# EAGLE design BuddyBand-BASIC-TOP (EAGLE 9.6.2)
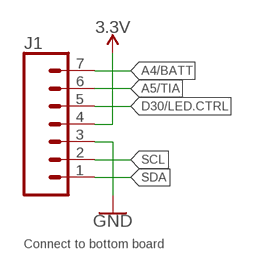
[diagram p0: schematic, sheet 1, part 1 of 2]
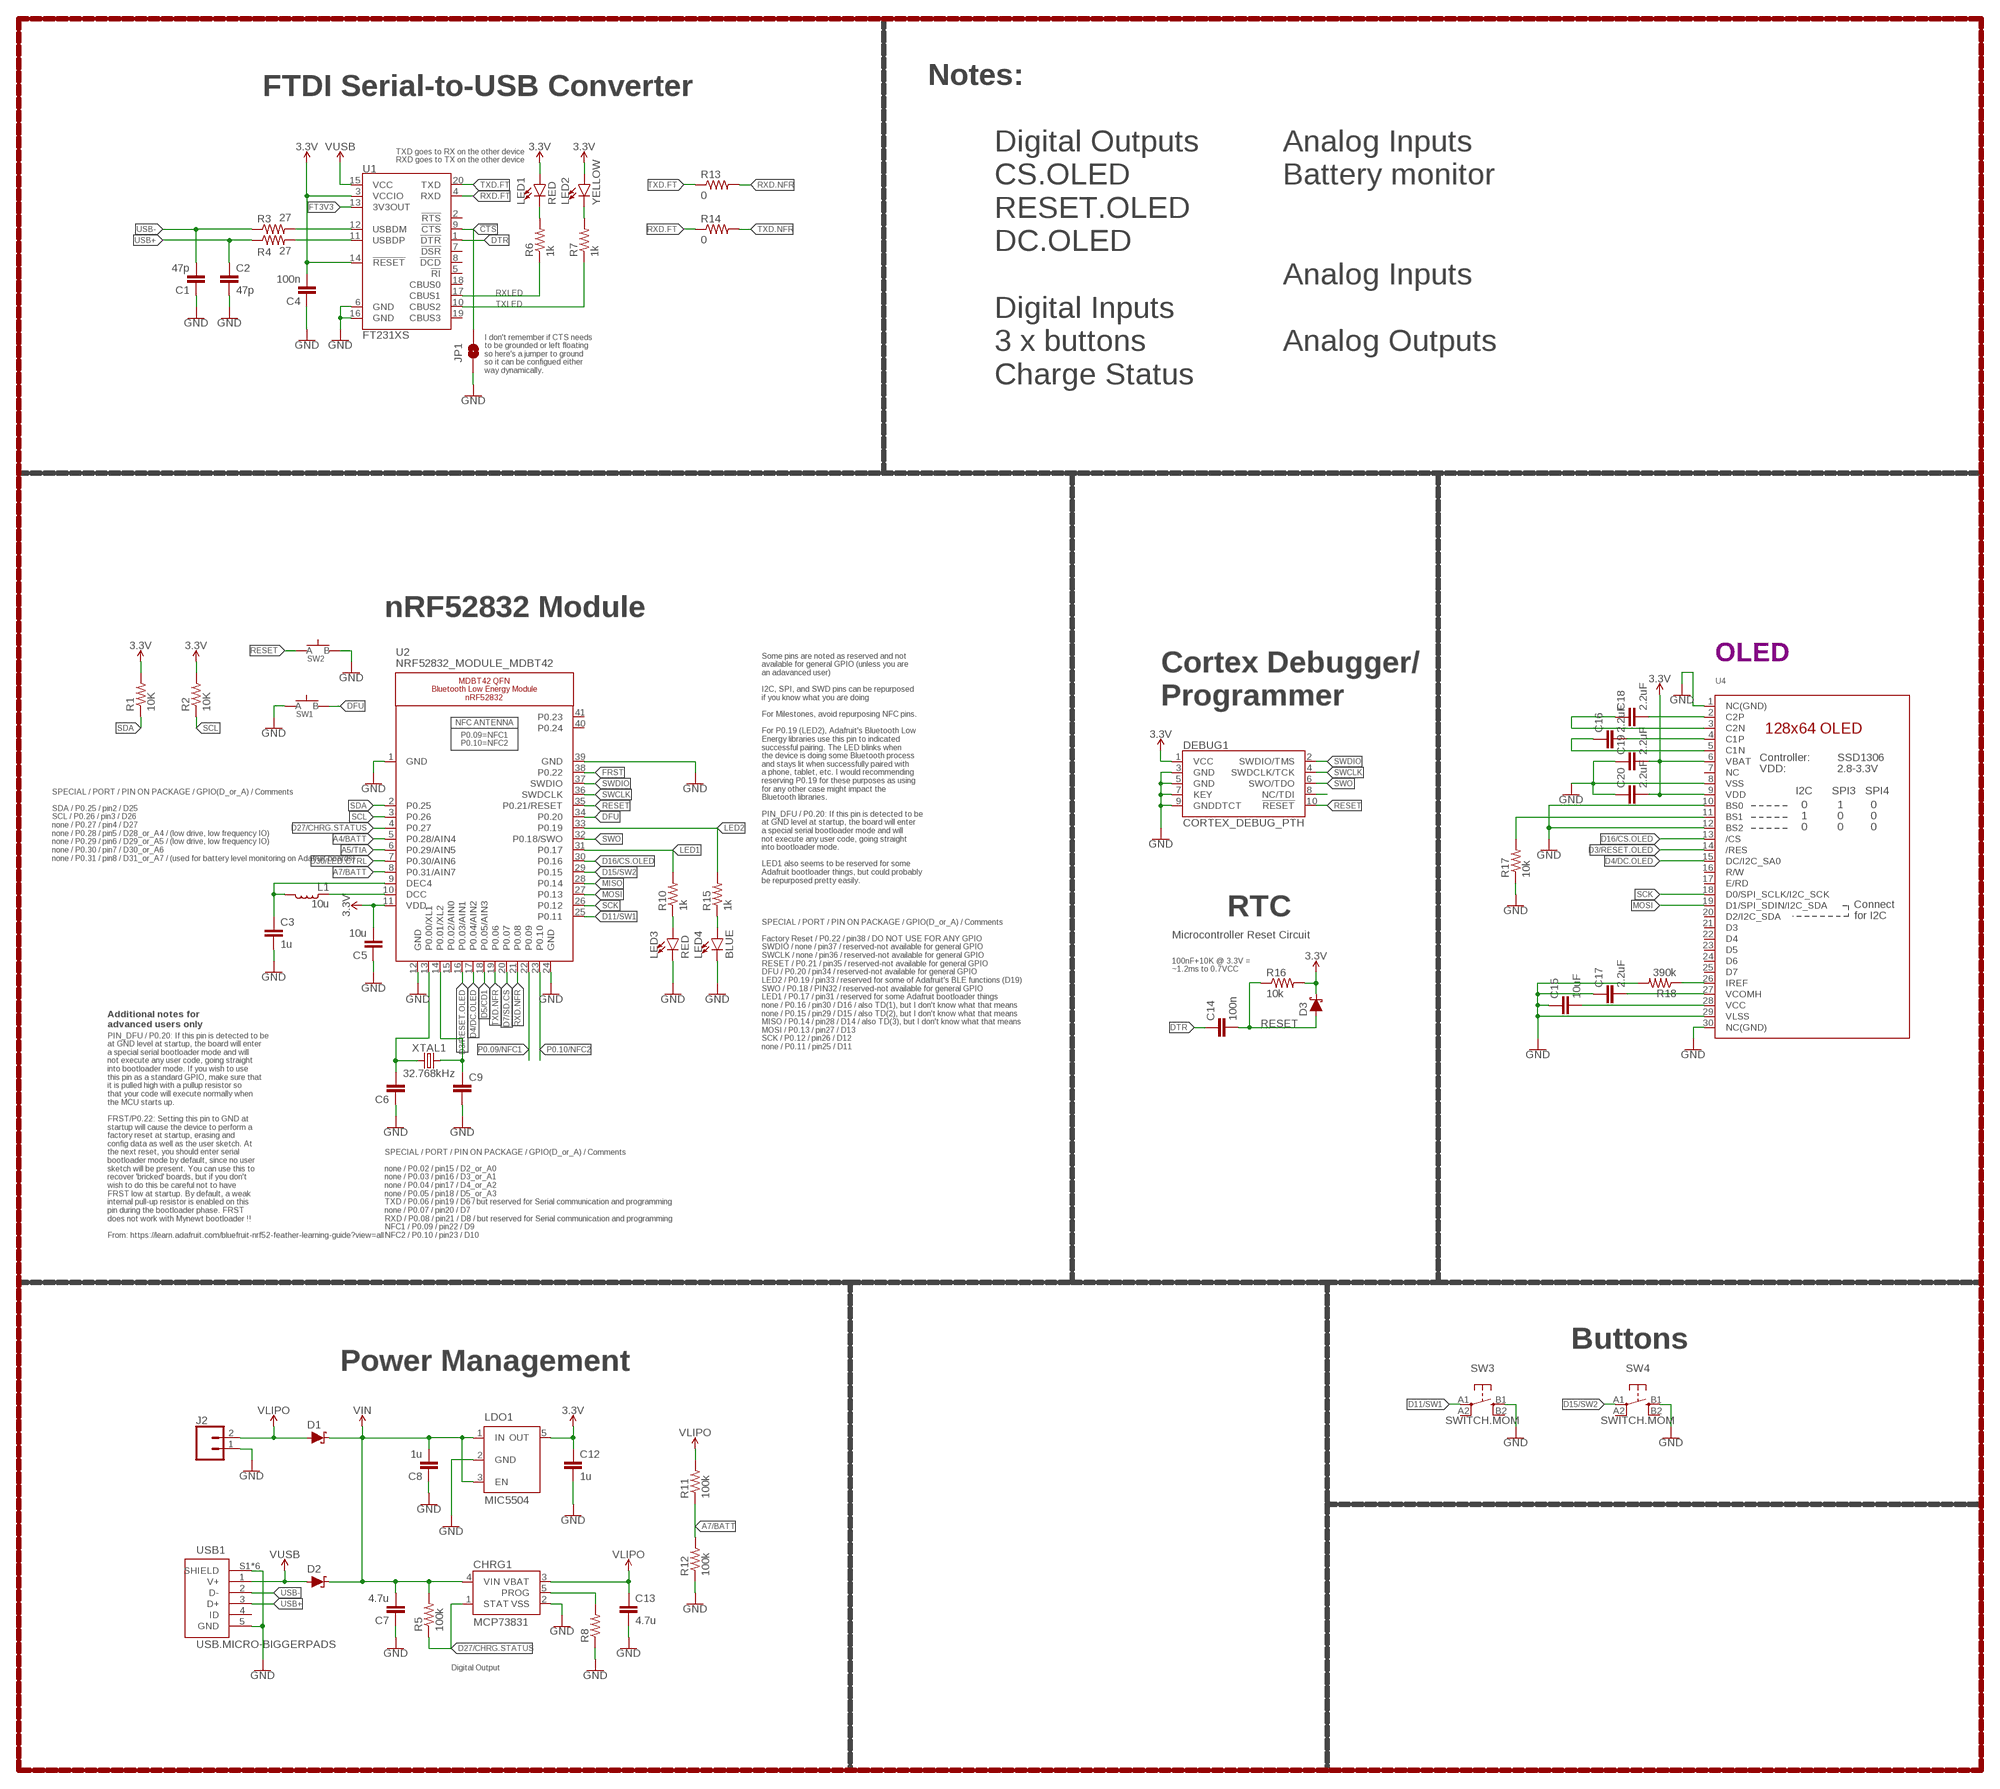
[diagram p1: schematic, sheet 1, part 2 of 2]

## Parts
C1  47p  CAPACITOR0603  [C0603]
C2  47p  CAPACITOR0603  [C0603]
C3  1u  CAPACITOR0603  [C0603]
C4  100n  CAPACITOR0603  [C0603]
C5  10u  CAPACITOR0805  [C0805]
C6  CAPACITOR0603  [C0603]
C7  4.7u  CAPACITOR0603  [C0603]
C8  1u  CAPACITOR0603  [C0603]
C9  CAPACITOR0603  [C0603]
C12  1u  CAPACITOR0603  [C0603]
C13  4.7u  CAPACITOR0603  [C0603]
C14  100n  CAPACITOR0603  [C0603]
C15  10uF  CAPACITOR0603  [C0603]
C16  2.2uF  CAPACITOR0402  [C0402]
C17  2.2uF  CAPACITOR0402  [C0402]
C18  2.2uF  CAPACITOR0402  [C0402]
C19  2.2uF  CAPACITOR0402  [C0402]
C20  2.2uF  CAPACITOR0402  [C0402]
CHRG1  MCP73831  [SOT23-5]
D1  SCHOTTKY-USC  [USC]
D2  SCHOTTKY-USC  [USC]
D3  SCHOTTKY-USC  [USC]
DEBUG1  CORTEX_DEBUG_PTH  [2X5-PTH-1.27MM]
J1  CONN_07-1.27MM  [1X07_1.27MM]
J2  CONN_02  [1X02]
JP1  JUMPER-SMT_2_NO_SILK  [SMT-JUMPER_2_NO_SILK]
L1  10u  INDUCTOR0603  [L0603]
LDO1  MIC5504  [SOT23-5]
LED1  RED  LED0603  [LED-0603]
LED2  YELLOW  LED0603  [LED-0603]
LED3  RED  LED0603  [LED-0603]
LED4  BLUE  LED0603  [LED-0603]
R1  10K  RESISTOR0603  [R0603]
R2  10K  RESISTOR0603  [R0603]
R3  27  RESISTOR0603  [R0603]
R4  27  RESISTOR0603  [R0603]
R5  100k  RESISTOR0603  [R0603]
R6  1k  RESISTOR0603  [R0603]
R7  1k  RESISTOR0603  [R0603]
R8  RESISTOR0603  [R0603]
R10  1k  RESISTOR0603  [R0603]
R11  100k  RESISTOR0603  [R0603]
R12  100k  RESISTOR0603  [R0603]
R13  0  RESISTOR0603  [R0603]
R14  0  RESISTOR0603  [R0603]
R15  1k  RESISTOR0603  [R0603]
R16  10k  RESISTOR0603  [R0603]
R17  10k  RESISTOR0603  [R0603]
R18  390k  RESISTOR0603  [R0603]
SW1  SPST-PTS830GG140-COPY.1-3  [BUTTON-GULLWING]
SW2  SPST-PTS830GG140-COPY.1-3  [BUTTON-GULLWING]
SW3  SWITCH.MOM  [TACTILE_SWITCH_SMD_6.2MM_TALL]
SW4  SWITCH.MOM  [TACTILE_SWITCH_SMD_6.2MM_TALL]
U1  FT231XS  [SSOP20_L]
U2  NRF52832_MODULE_MDBT42  [BLE_MODULE_RAYTAC_MDBT42]
U4  DISP_OLED_UG-2864HSWEG01-NO-WRAPAROUND  [UG-2864HSWEG01_0.96IN_NO-WRAPAROUND]
USB1  USB.MICRO-BIGGERPADS  [USB-MICRO-01.BIGGERPADS]
XTAL1  32.768kHz  CRYSTALECS-.327-12.5-12-C-TR  [2-SMD.NOLEAD.2.0MMTO1.2MM]

## Nets
3.3V: C4.2 C5.2 C12.1 C19.2 C20.2 D3.-(C) DEBUG1.1(VCC) J1.4 LDO1.5(OUT) LED1.A LED2.A R1.2 R2.2 R16.2 U1.3(VCCIO) U1.14(!RESET) U2.11(VDD) U4.6(VBAT) U4.9(VDD)
!CTS: JP1.2 U1.9(!CTS)
A4/BATT: J1.7 U2.5(P0.28/AIN4)
A5/TIA: J1.6 U2.6(P0.29/AIN5)
A7/BATT: R11.1 R12.2 U2.8(P0.31/AIN7)
D3/RESET.OLED: U2.16(P0.03/AIN1) U4.14(/RES)
D4/DC.OLED: U2.17(P0.04/AIN2) U4.15(DC/I2C_SA0)
D5/CD1: U2.18(P0.05/AIN3)
D7/SD.CS: U2.20(P0.07)
D11/SW1: SW3.A1 U2.25(P0.11)
D15/SW2: SW4.A1 U2.29(P0.15)
D16/CS.OLED: U2.30(P0.16) U4.13(/CS)
D27/CHRG.STATUS: CHRG1.1(STAT) R5.1 U2.4(P0.27)
D30/LED.CTRL: J1.5 U2.7(P0.30/AIN6)
DFU: SW1.3(B) U2.34(P0.20)
DTR: C14.1 U1.1(!DTR)
FRST: U2.38(P0.22)
FT3V3: U1.13(3V3OUT)
GND: C1.1 C2.2 C3.2 C4.1 C5.1 C6.1 C7.1 C8.1 C9.2 C12.2 C13.2 C15.1 C17.1 C19.1 C20.1 CHRG1.2(VSS) DEBUG1.3(GND) DEBUG1.5(GND) DEBUG1.7(KEY) DEBUG1.9(GNDDTCT) J1.3 J2.1 JP1.1 LDO1.2(GND) LED3.C LED4.C R8.1 R12.1 R17.1 R18.2 SW1.1(A) SW2.3(B) SW3.B1 SW4.B1 U1.6(GND) U1.16(GND) U2.1(GND) U2.12(GND) U2.24(GND) U2.39(GND) U4.1(NC(GND)) U4.8(VSS) U4.10(BS0) U4.12(BS2) U4.29(VLSS) U4.30(NC(GND)) USB1.5(GND) USB1.S1(SHIELD) USB1.S2(SHIELD) USB1.S3(SHIELD) USB1.S4(SHIELD) USB1.S5(SHIELD) USB1.S6(SHIELD)
LED1: R10.2 U2.31(P0.17)
LED2: R15.2 U2.33(P0.19)
MISO: U2.28(P0.14)
MOSI: U2.27(P0.13) U4.19(D1/SPI_SDIN/I2C_SDA)
N$1: R17.2 U4.11(BS1)
N$2: R18.1 U4.26(IREF)
N$3: C18.2 U4.2(C2P)
N$4: C6.2 U2.13(P0.00/XL1) XTAL1.P$1
N$5: C18.1 U4.3(C2N)
N$6: C9.1 U2.14(P0.01/XL2) XTAL1.P$2
N$7: C16.2 U4.4(C1P)
N$8: C16.1 U4.5(C1N)
N$9: LED3.A R10.1
N$10: LED4.A R15.1
N$11: L1.1 U2.10(DCC)
N$12: C3.1 L1.2 U2.9(DEC4)
N$13: C15.2 U4.28(VCC)
N$14: DEBUG1.8(NC/TDI)
N$15: C17.2 U4.27(VCOMH)
N$17: CHRG1.5(PROG) R8.2
N$23: R3.2 U1.12(USBDM)
N$24: R4.2 U1.11(USBDP)
N$25: LED1.C R6.2
N$26: LED2.C R7.2
P0.09/NFC1: U2.22(P0.09)
P0.10/NFC2: U2.23(P0.10)
RESET: C14.2 D3.+(A) DEBUG1.10(!RESET) R16.1 SW2.1(A) U2.35(P0.21/RESET)
RXD.FT: R14.1 U1.4(RXD)
RXD.NFR: R13.2 U2.21(P0.08)
RXLED: R6.1 U1.17(CBUS1)
SCK: U2.26(P0.12) U4.18(D0/SPI_SCLK/I2C_SCK)
SCL: J1.2 R2.1 U2.3(P0.26)
SDA: J1.1 R1.1 U2.2(P0.25)
SWCLK: DEBUG1.4(SWDCLK/TCK) U2.36(SWDCLK)
SWDIO: DEBUG1.2(SWDIO/TMS) U2.37(SWDIO)
SWO: DEBUG1.6(SWO/TDO) U2.32(P0.18/SWO)
TXD.FT: R13.1 U1.20(TXD)
TXD.NFR: R14.2 U2.19(P0.06)
TXLED: R7.1 U1.10(CBUS2)
USB+: C2.1 R4.1 USB1.3(D+)
USB-: C1.2 R3.1 USB1.2(D-)
V_USB: D2.+(A) U1.15(VCC) USB1.1(V+) ; supply symbol labelled VUSB
VIN: C7.2 C8.2 CHRG1.4(VIN) D1.-(C) D2.-(C) LDO1.1(IN) LDO1.3(EN) R5.2
VLIPO: C13.1 CHRG1.3(VBAT) D1.+(A) J2.2 R11.2
Unconnected: SW3.A2 SW3.B2 SW4.A2 SW4.B2 U1.2(!RTS) U1.5(!RI) U1.7(!DSR) U1.8(!DCD) U1.18(CBUS0) U1.19(CBUS3) U2.15(P0.02/AIN0) U2.40(P0.24) U2.41(P0.23) U4.7(NC) U4.16(R/W) U4.17(E/RD) U4.20(D2/I2C_SDA) U4.21(D3) U4.22(D4) U4.23(D5) U4.24(D6) U4.25(D7) USB1.4(ID)

## Notes on the sheet
- Notes:
- FTDI Serial-to-USB Converter
- TXD goes to RX on the other device
  RXD goes to TX on the other device
- Analog Inputs
  Battery monitor
  
  
  Analog Inputs
  
  Analog Outputs
- I don't remember if CTS needs
  to be grounded or left floating
  so here's a jumper to ground
  so it can be configued either
  way dynamically.
- Digital Outputs
  CS.OLED
  RESET.OLED
  DC.OLED
  
  Digital Inputs
  3 x buttons
  Charge Status
- nRF52832 Module
- Connect to bottom board
- OLED
- Cortex Debugger/
  Programmer
- SPECIAL / PORT / PIN ON PACKAGE / GPIO(D_or_A) / Comments
  
  SDA / P0.25 / pin2 / D25
  SCL / P0.26 / pin3 / D26
  none / P0.27 / pin4 / D27
  none / P0.28 / pin5 / D28_or_A4 / (low drive, low frequency IO)
  none / P0.29 / pin6 / D29_or_A5 / (low drive, low frequency IO)
  none / P0.30 / pin7 / D30_or_A6
  none / P0.31 / pin8 / D31_or_A7 / (used for battery level monitoring on Adafruit boards)
- Some pins are noted as reserved and not
  available for general GPIO (unless you are
  an adavanced user)
  
  I2C, SPI, and SWD pins can be repurposed
  if you know what you are doing
  
  For Milestones, avoid repurposing NFC pins.
  
  For P0.19 (LED2), Adafruit's Bluetooth Low
  Energy libraries use this pin to indicated
  successful pairing. The LED blinks when
  the device is doing some Bluetooth process
  and stays lit when successfully paired with
  a phone, tablet, etc. I would recommending
  reserving P0.19 for these purposes as using
  for any other case might impact the
  Bluetooth libraries.
  
  PIN_DFU / P0.20: If this pin is detected to be
  at GND level at startup, the board will enter
  a special serial bootloader mode and will
  not execute any user code, going straight
  into bootloader mode.
  
  LED1 also seems to be reserved for some
  Adafruit bootloader things, but could probably
  be repurposed pretty easily.
- RTC
- Microcontroller Reset Circuit
- 100nF+10K @ 3.3V =
  ~1.2ms to 0.7VCC
- Additional notes for
  advanced users only
- SPECIAL / PORT / PIN ON PACKAGE / GPIO(D_or_A) / Comments
  
  Factory Reset / P0.22 / pin38 / DO NOT USE FOR ANY GPIO
  SWDIO / none / pin37 / reserved-not available for general GPIO
  SWCLK / none / pin36 / reserved-not available for general GPIO
  RESET / P0.21 / pin35 / reserved-not available for general GPIO
  DFU / P0.20 / pin34 / reserved-not available for general GPIO
  LED2 / P0.19 / pin33 / reserved for some of Adafruit's BLE functions (D19)
  SWO / P0.18 / PIN32 / reserved-not available for general GPIO
  LED1 / P0.17 / pin31 / reserved for some Adafruit bootloader things
  none / P0.16 / pin30 / D16 / also TD(1), but I don't know what that means
  none / P0.15 / pin29 / D15 / also TD(2), but I don't know what that means
  MISO / P0.14 / pin28 / D14 / also TD(3), but I don't know what that means
  MOSI / P0.13 / pin27 / D13
  SCK / P0.12 / pin26 / D12
  none / P0.11 / pin25 / D11
- PIN_DFU / P0.20: If this pin is detected to be
  at GND level at startup, the board will enter
  a special serial bootloader mode and will
  not execute any user code, going straight
  into bootloader mode. If you wish to use
  this pin as a standard GPIO, make sure that
  it is pulled high with a pullup resistor so
  that your code will execute normally when
  the MCU starts up.
  
  FRST/P0.22: Setting this pin to GND at
  startup will cause the device to perform a
  factory reset at startup, erasing and
  config data as well as the user sketch. At
  the next reset, you should enter serial
  bootloader mode by default, since no user
  sketch will be present. You can use this to
  recover 'bricked' boards, but if you don't
  wish to do this be careful not to have
  FRST low at startup. By default, a weak
  internal pull-up resistor is enabled on this
  pin during the bootloader phase. FRST
  does not work with Mynewt bootloader !!
  
  From: https://learn.adafruit.com/bluefruit-nrf52-feather-learning-guide?view=all
- SPECIAL / PORT / PIN ON PACKAGE / GPIO(D_or_A) / Comments
  
  none / P0.02 / pin15 / D2_or_A0
  none / P0.03 / pin16 / D3_or_A1
  none / P0.04 / pin17 / D4_or_A2
  none / P0.05 / pin18 / D5_or_A3
  TXD / P0.06 / pin19 / D6 / but reserved for Serial communication and programming
  none / P0.07 / pin20 / D7
  RXD / P0.08 / pin21 / D8 / but reserved for Serial communication and programming
  NFC1 / P0.09 / pin22 / D9
  NFC2 / P0.10 / pin23 / D10
- Buttons
- Power Management
- Digital Output

## Library data of the parts
C1-C9 C12-C20 = LinnesLab-Passives:CAPACITOR
CHRG1 = LinnesLab-Power:MCP73831: MCP73831T Li-Ion, Li-Pol Controller Miniature single cell, fully integrated Li-Ion, Li-polymer charge management controller Datasheet <http://ww1.microchip.com/downloads/en/DeviceDoc/20001984g.pdf> SparkFun Products: SparkFun ESP32 Thing <https://www.sparkfun.com/products/13907> SparkFun 9DoF Razor IMU M0 <https://www.sparkfun.com/products/14001>; PROD_ID: IC-09995
D1-D3 = LinnesLab-DiscreteSemi:SCHOTTKY: Schottky diode A Schottky diode is a semiconductor diode which has a low forward voltage drop and a very fast switching action. Example: Digi-Key Part Number: RB161MM-20CT-ND
DEBUG1 = LinnesLab-Connectors:CORTEX_DEBUG: Cortex Debug Connector - 10 pin Supports JTAG debug, Serial Wire debug, and Serial Wire Viewer. PTH and SMD connector options available. General Connector Information <http://infocenter.arm.com/help/topic/com.arm.doc.faqs/attached/13634/cortex_debug_connectors.pdf> Products: PTH Connector <http://www.digikey.com/product-detail/en/cnc-tech/3220-10-0100-00/1175-1627-ND/3883661> -via Digi-Key SparkFun PSoc <https://www.sparkfun.com/products/13229> SparkFun T <https://www.sparkfun.com/products/13810>
J1 = LinnesLab-Connectors:CONN_07: Multi connection point. Often used as Generic Header-pin footprint for 0.1 inch spaced/style header connections On any of the 0.1 inch spaced packages, you can populate with these: Break Away Headers - Straight <https://www.sparkfun.com/products/116> (PRT-00116) Break Away Male Headers - Right Angle <https://www.sparkfun.com/products/553> (PRT-00553) Female Headers <https://www.sparkfun.com/products/115> (PRT-00115) Break Away Headers - Machine Pin <https://www.sparkfun.com/products/117> (PRT-00117) Break Away Female Headers - Swiss Machine Pin <https://www.sparkfun.com/products/743> (PRT-00743) For SCREWTERMINALS and SPRING TERMINALS visit here: Screw Terimnals on SparkFun.com <https://www.sparkfun.com/search/results?term=Screw+Terminals> (5mm/3.5mm/2.54mm spacing) This device is also useful as a general connection point to wire up your design to another part of your project. Our various solder wires solder well into these plated through hole pads. Hook-Up Wire - Assortment (Stranded, 22 AWG) <https://www.sparkfun.com/products/11375> (PRT-11375) Hook-Up Wire - Assortment (Solid Core, 22 AWG) <https://www.sparkfun.com/products/11367> (PRT-11367) View the entire wire category on our website here <https://www.sparkfun.com/categories/141> Special notes: Molex polarized connector foot print use with SKU : PRT-08231 with associated crimp pins and housings. 1MM SMD Version SKU: PRT-10208 NOTES ON THE VARIANTS LOCK and LOCK_LONGPADS... This footprint was designed to help hold the alignment of a through-hole component (i.e. 6-pin header) while soldering it into place. You may notice that each hole has been shifted either up or down by 0.005 of an inch from it's more standard position (which is a perfectly straight line). This slight alteration caused the pins (the squares in the middle) to touch the edges of the holes. Because they are alternating, it causes a "brace" to hold the component in place. 0.005 has proven to be the perfect amount of "off-center" position when using our standard breakaway headers. Although looks a little odd when you look at the bare footprint, once you have a header in there, the alteration is very hard to notice. Also,if you push a header all the way into place, it is covered up entirely on the bottom side.
J2 = LinnesLab-Connectors:CONN_02: Multi connection point. Often used as Generic Header-pin footprint for 0.1 inch spaced/style header connections On any of the 0.1 inch spaced packages, you can populate with these: Break Away Headers - Straight <https://www.sparkfun.com/products/116> (PRT-00116) Break Away Male Headers - Right Angle <https://www.sparkfun.com/products/553> (PRT-00553) Female Headers <https://www.sparkfun.com/products/115> (PRT-00115) Break Away Headers - Machine Pin <https://www.sparkfun.com/products/117> (PRT-00117) Break Away Female Headers - Swiss Machine Pin <https://www.sparkfun.com/products/743> (PRT-00743) For SCREWTERMINALS and SPRING TERMINALS visit here: Screw Terimnals on SparkFun.com <https://www.sparkfun.com/search/results?term=Screw+Terminals> (5mm/3.5mm/2.54mm spacing) This device is also useful as a general connection point to wire up your design to another part of your project. Our various solder wires solder well into these plated through hole pads. Hook-Up Wire - Assortment (Stranded, 22 AWG) <https://www.sparkfun.com/products/11375> (PRT-11375) Hook-Up Wire - Assortment (Solid Core, 22 AWG) <https://www.sparkfun.com/products/11367> (PRT-11367) View the entire wire category on our website here <https://www.sparkfun.com/categories/141> Special notes: Molex polarized connector foot print use with: PRT-08233 with associated crimp pins and housings. 2.54_SCREWTERM for use with PRT-10571. 3.5mm Screw Terminal footprints for PRT-08084 5mm Screw Terminal footprints for use with PRT-08432
JP1 = LinnesLab-Switches:JUMPER-SMT_2_NO: Normally open jumper This jumper has two pads in close proximity to each other. Apply solder to close the connection. Round pads are easier to solder for beginners, but are a lot larger. SparkFun Product that uses the round pads: SparkFun EL Sequencer <https://www.sparkfun.com/products/12781>
L1 = LinnesLab-Passives:INDUCTOR
LDO1 = LinnesLab-Power:MIC5504: MIC5504 Voltage Regulator Output Voltages: 1.0V to 3.3V Input Voltages: 2.5V to 5.5V Link to Datasheet http://ww1.microchip.com/downloads/en/DeviceDoc/MIC550X.pdf
LED1-LED4 = LinnesLab-LED:LED: LED (Generic) Standard schematic elements and footprints for 5mm, 3mm, 1206, and 0603 sized LEDs. Generic LEDs with no color specified. LTST-C190KGKT: arrow indicates cathode
R1-R8 R10-R18 = LinnesLab-Passives:RESISTOR
SW1 SW2 = LinnesLab-Switches:SPST-PTS830GG140-COPY
SW3 SW4 = LinnesLab-Switches:SWITCH.MOM: PTS645SM43SMTR92 LFS
U1 = LinnesLab-DigitalIC:FT231X: FTDI FT231X Full Speed USB to Full-handshake UART This USB2.0 Full Speed IC offers a compact bridge to full handshake UART interfaces. The device is a UART, capable of operating up to 3MBaud, with low power consumption (8mA). The FT231X includes the complete FT-X series feature set and enables USB to be added into a system design quickly and easily over a UART interface. Datasheet <http://cdn.sparkfun.com/datasheets/Components/General%20IC/DS_FT231X.pdf>; DIGIKEY: 768-1156-5-ND; MFN: FT231XS-U
U2 = LinnesLab-Microcontrollers:NRF52832_MODULE_MDBT42: MDBT42 - BLE Module (nRF52832 QFN) VDD: 1.7-3.6V
U4 = LinnesLab-Displays:DISP_OLED_UG-2864HSWEG01: UG-2864HSWEG01 OLED display Both 1.3" and 0.96" models share the same FPC tab footprint, only the screen dimensions vary.
USB1 = LinnesLab-Connectors:USB.MICRO: DigiKey PN: 609-4613-1-ND
XTAL1 = LinnesLab-Clocks:CRYSTAL; DIGIKEY: XC2288CT-ND; FREQ: 32.7680KHZ; LOAD_CAP: 12.5pF

## Board
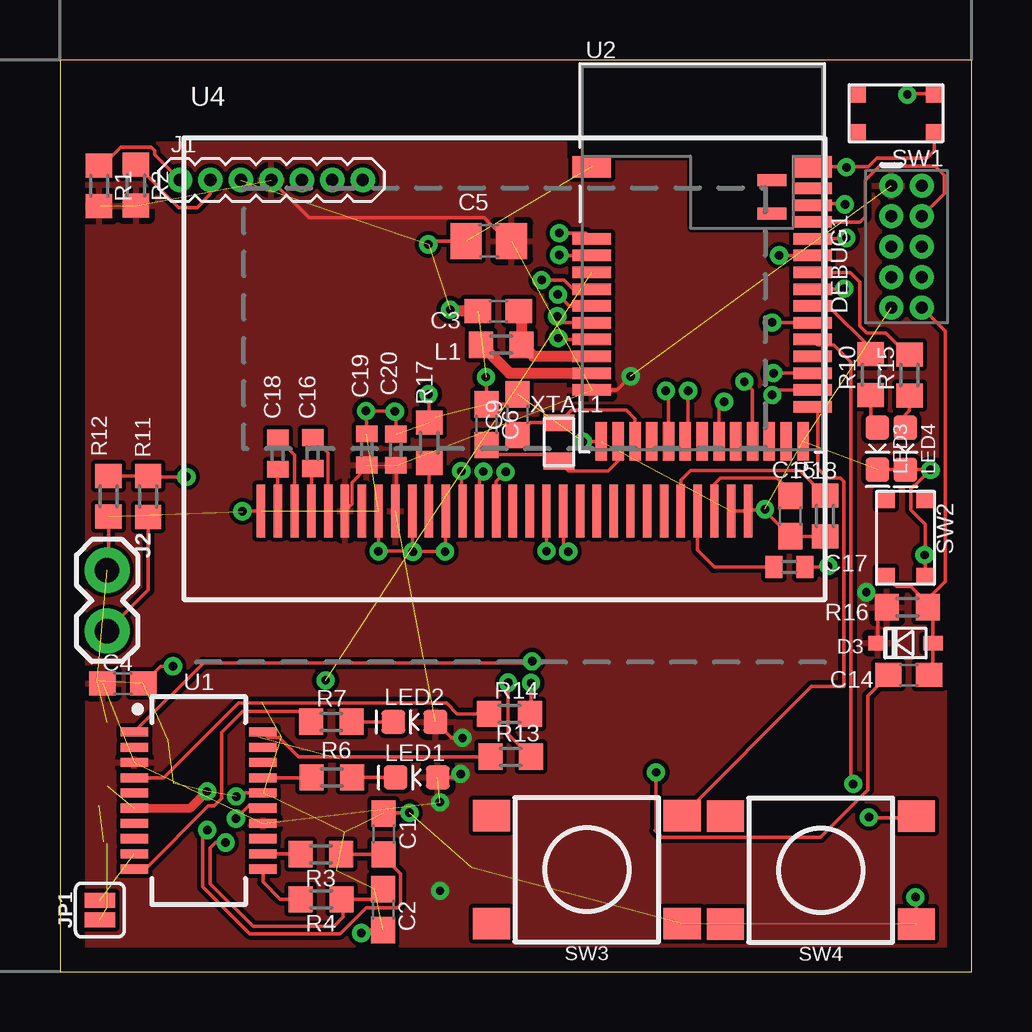
[diagram p2: board, top side]
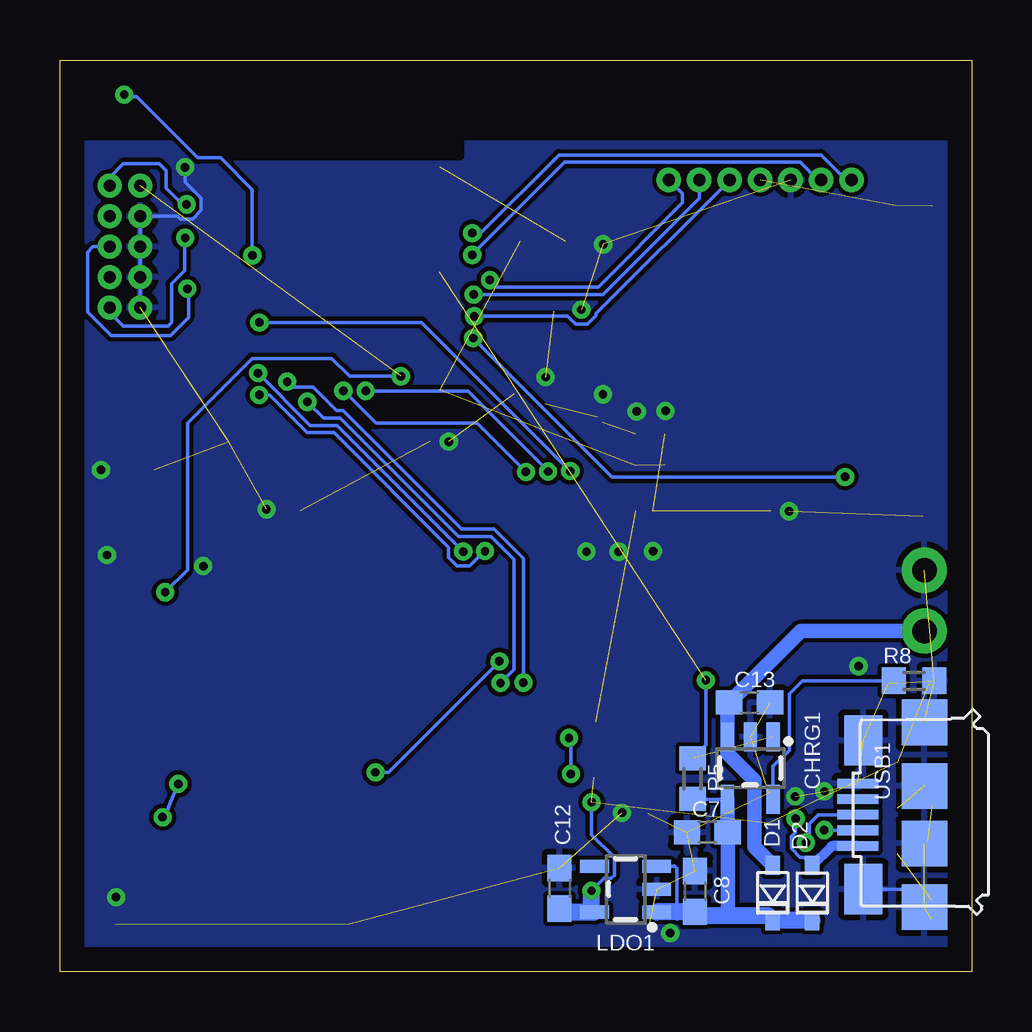
[diagram p3: board, bottom side, seen from below]

Size 38 x 38 mm. Coordinates in mm from the lower left corner, seen from the top.
Outline: 0,0 38,0 38,38 0,38 0,0
Copper layers (1*16): Top 0.035mm / dielectric 1.5mm / Bottom 0.035mm
Design rules "default": minimum track width 6mil, minimum drill 0.35mm, track to track 6mil, track to pad 6mil, pad to pad 6mil, via to via 6mil, smd to smd 6mil, copper to edge 40mil, drill to drill 6mil, minimum pad ring 10mil, minimum via ring 8mil, stop-mask expansion 4mil, vias tented up to drill 0mil, thermal gap 10mil

### Footprints (pad centres in the part's own frame; a part is rotated, then mirrored left to right if it is on the bottom)
C0603 = smd 1.1 x 1: 1 -0.85,0; 2 0.85,0
C0805 = smd 1.3 x 1.5: 1 -0.95,0; 2 0.95,0
C0402 = smd 0.7 x 0.9: 1 -0.65,0; 2 0.65,0
SOT23-5 = smd 0.55 x 1.2: 1 -0.95,-1.3; 2 0,-1.3; 3 0.95,-1.3; 4 0.95,1.3; 5 -0.95,1.3
USC = smd 0.8 x 0.6: + -1.15,0; - 1.15,0
2X5-PTH-1.27MM = drill 0.508 pad 1: 1 -2.54,-0.635; 2 -2.54,0.635; 3 -1.27,-0.635; 4 -1.27,0.635; 5 0,-0.635; 6 0,0.635; 7 1.27,-0.635; 8 1.27,0.635; 9 2.54,-0.635; 10 2.54,0.635
1X07_1.27MM = drill 0.508 pad 1: 1 0,0; 2 1.27,0; 3 2.54,0; 4 3.81,0; 5 5.08,0; 6 6.35,0; 7 7.62,0
1X02 = drill 1.016 pad 1.88: 1 0,0; 2 2.54,0
SMT-JUMPER_2_NO_SILK = smd 0.635 x 1.27: 1 -0.406,0; 2 0.406,0
L0603 = smd 1 x 1.1: 1 -0.85,0; 2 0.85,0
LED-0603 = smd 1 x 1: A -0.877,0; C 0.877,0
R0603 = smd 1 x 1.1: 1 -0.85,0; 2 0.85,0
BUTTON-GULLWING = smd 0.7 x 0.75: 1 -1.6,0.825; 2 1.6,0.825; 3 -1.6,-0.825; 4 1.6,-0.825
TACTILE_SWITCH_SMD_6.2MM_TALL = smd 1.55 x 1.3: A1 -3.975,-2.25; A2 3.975,-2.25; B1 -3.975,2.25; B2 3.975,2.25
SSOP20_L = smd 0.381 x 1.143: 1 -2.857,-2.68; 2 -2.223,-2.68; 3 -1.587,-2.68; 4 -0.953,-2.68; 5 -0.318,-2.68; 6 0.318,-2.68; 7 0.953,-2.68; 8 1.587,-2.68; 9 2.223,-2.68; 10 2.857,-2.68; 11 2.857,2.68; 12 2.223,2.68; 13 1.587,2.68; 14 0.953,2.68; 15 0.318,2.68; 16 -0.318,2.68; 17 -0.953,2.68; 18 -1.587,2.68; 19 -2.223,2.68; 20 -2.857,2.68
BLE_MODULE_RAYTAC_MDBT42 = smd 1.6 x 0.9: 1 -4.6,3.8; 39 4.6,3.8 | smd 1.6 x 0.48: 2 -4.6,0.8; 3 -4.6,0.1; 4 -4.6,-0.6; 5 -4.6,-1.3; 6 -4.6,-2; 7 -4.6,-2.7; 8 -4.6,-3.4; 9 -4.6,-4.1; 10 -4.6,-4.8; 11 -4.6,-5.5; 25 4.6,-6.2; 26 4.6,-5.5; 27 4.6,-4.8; 28 4.6,-4.1; 29 4.6,-3.4; 30 4.6,-2.7; 31 4.6,-2; 32 4.6,-1.3; 33 4.6,-0.6; 34 4.6,0.1; 35 4.6,0.8; 36 4.6,1.5; 37 4.6,2.2; 38 4.6,2.9 | smd 0.48 x 1.6: 12 -4.2,-7.65; 13 -3.5,-7.65; 14 -2.8,-7.65; 15 -2.1,-7.65; 16 -1.4,-7.65; 17 -0.7,-7.65; 18 0,-7.65; 19 0.7,-7.65; 20 1.4,-7.65; 21 2.1,-7.65; 22 2.8,-7.65; 23 3.5,-7.65; 24 4.2,-7.65 | smd 1.2 x 0.5: 40 2.9,3.25; 41 2.9,1.85
UG-2864HSWEG01_0.96IN_NO-WRAPAROUND = smd 0.35 x 2.2: 1 -10.15,-1.2; 2 -9.45,-1.2; 3 -8.75,-1.2; 4 -8.05,-1.2; 5 -7.35,-1.2; 6 -6.65,-1.2; 7 -5.95,-1.2; 8 -5.25,-1.2; 9 -4.55,-1.2; 10 -3.85,-1.2; 11 -3.15,-1.2; 12 -2.45,-1.2; 13 -1.75,-1.2; 14 -1.05,-1.2; 15 -0.35,-1.2; 16 0.35,-1.2; 17 1.05,-1.2; 18 1.75,-1.2; 19 2.45,-1.2; 20 3.15,-1.2; 21 3.85,-1.2; 22 4.55,-1.2; 23 5.25,-1.2; 24 5.95,-1.2; 25 6.65,-1.2; 26 7.35,-1.2; 27 8.05,-1.2; 28 8.75,-1.2; 29 9.45,-1.2; 30 10.15,-1.2
USB-MICRO-01.BIGGERPADS = smd 0.4 x 1.7: 1 -1.3,1.505; 2 -0.65,1.505; 3 0,1.505; 4 0.65,1.505; 5 1.3,1.505 | smd 1.9 x 1.9: S1 -3.85,-1.27; S2 -1.2,-1.27; S3 1.2,-1.27; S4 3.85,-1.27 | smd 2.1 x 1.6: S5 -3.1,1.28; S6 3.1,1.28
2-SMD.NOLEAD.2.0MMTO1.2MM = smd 0.7 x 1.3: P$1 -0.8,0; P$2 0.8,0

### Placement (x,y rotation side)
C1  13.5,5.74 270 top
C2  13.46,2.58 270 top
C3  18.27,27.52 180 top
C4  2.63,12.01 180 top
C5  17.88,30.45 0 top
C6  17.77,22.8 270 top
C7  11.01,5.8 0 bottom
C8  11.53,3.34 270 bottom
C9  19.08,23.21 90 top
C12  17.17,3.47 90 bottom
C13  9.25,11.21 0 bottom
C14  35.38,12.35 0 top
C15  30.44,18.99 90 top
C16  10.54,21.61 270 top
C17  30.41,16.86 180 top
C18  9.08,21.59 270 top
C19  12.79,21.76 270 top
C20  14,21.75 270 top
CHRG1  9.22,8.48 180 bottom
D1  8.29,3.28 270 bottom
D2  6.64,3.27 270 bottom
D3  35.25,13.69 180 top
DEBUG1  35.29,30.22 270 top
J1  5,33 0 top
J2  1.96,16.73 270 top
JP1  1.66,2.56 90 top
L1  18.4,26.13 0 top
LDO1  14.42,3.43 90 bottom
LED1  14.87,8.09 180 top
LED2  14.78,10.41 180 top
LED3  34.08,21.8 270 top
LED4  35.24,21.8 270 top
R1  1.63,32.75 270 top
R2  3.17,32.78 270 top
R3  10.88,4.89 180 top
R4  10.89,3.01 180 top
R5  11.63,8.04 270 bottom
R6  11.33,8.09 0 top
R7  11.32,10.41 0 top
R8  2.4,12.12 180 bottom
R10  33.79,24.88 90 top
R11  3.68,19.8 270 top
R12  2.02,19.81 90 top
R13  18.79,8.95 0 top
R14  18.74,10.74 0 top
R15  35.41,24.86 90 top
R16  35.33,15.19 180 top
R17  15.39,22.04 270 top
R18  31.89,18.99 270 top
SW1  34.85,35.77 180 top
SW2  35.25,18.08 90 top
SW3  21.96,4.25 180 top
SW4  31.72,4.23 180 top
U1  5.78,7.13 270 top
U2  26.77,29.75 0 top
U4  18.53,20.4 0 top
USB1  3.23,6.54 90 bottom
XTAL1  20.8,22.08 90 top

### Tracks (layer width: path | path; a pad name or v marks a point on that pad's centre or on a via)
3.3V  (via drill 0.35)  (11 unrouted)
  Top 0.152: C20.2 14,19.22 U4.9 | U4.6 12.18,19.5 12.18,20.39 12.79,21.01 C19.2 | D3.- 34.09,14.8 R16.2 33.85,15.81 v33.61,15.81 | v23.79,24.81 23.22,24.25 U2.11 | C5.2 18.65,30.45 17.67,31.43 10.38,31.43 J1.4 | LED1.A 16.56,8.09 v16.7,8.23 | v16.78,9.73 16.33,9.73 LED2.A
  Bottom 0.152: v33.61,15.81 32.69,16.74 32.69,22.86 30,25.55 26.67,25.55 25.93,24.81 v23.79,24.81 | v15.85,3.37 15.33,3.88 15.03,3.88 14.89,4.01 14.89,4.75 15.84,5.7 v15.84,7.06 | v16.7,8.23 16.7,9.66 v16.78,9.73
  Bottom 0.711: C12.1 17.03,2.48 LDO1.5 15.85,2.6 v15.85,3.37
  pour Top (isolate 0.178): 37.81,34.53 37.81,0.17 0.18,0.17 0.18,34.53
!CTS  (1 unrouted)
A4/BATT  (via drill 0.35)
  Top 0.152: U2.5 21.39,28.45 21.01,28.83 v20.08,28.83
  Bottom 0.152: v20.08,28.83 19.78,28.53 15.56,28.53 12.05,32.04 12.05,32.43 J1.7
A5/TIA  (via drill 0.35)
  Top 0.152: U2.6 21.23,27.75 v20.76,28.22
  Bottom 0.152: v20.76,28.22 15.36,28.22 11.35,32.23 J1.6
A7/BATT  (via drill 0.35)
  Top 0.152: R11.1 3.53,20.65 | 3.53,20.65 2.03,20.65 R12.2 | U2.8 20.83,26.35 v20.77,26.41 | v5.27,20.62 3.56,20.62 3.53,20.65
  Bottom 0.152: v20.77,26.41 14.99,20.62 v5.27,20.62
D3/RESET.OLED  (via drill 0.35)
  Top 0.152: U4.14 17.48,20.67 v17.65,20.84 | U2.16 25.37,24.09 v25.26,24.21
  Bottom 0.152: v17.65,20.84 17.65,20.86 21,24.21 v25.26,24.21
D4/DC.OLED  (via drill 0.35)
  Top 0.152: U4.15 18.18,20.43 v18.58,20.83 | v26.19,24.21 26.19,22.21 U2.17
  Bottom 0.152: v26.19,24.21 v26.18,24.21 24.83,22.86 20.61,22.86 v18.58,20.83
D11/SW1
  Top 0.152: U2.25 31.59,23.33 31.59,20.97 31.99,20.57 32.54,20.57 32.69,20.42 32.69,11.89 31.33,11.89 SW3.A1
D15/SW2  (via drill 0.35)
  Top 0.152: U2.29 31.6,26.11 32.27,26.11 32.97,25.41 32.97,7.92 v33.07,7.82 | v33.72,6.43 33.75,6.41 35.62,6.41 SW4.A1
  Bottom 0.152: v33.72,6.43 33.64,6.43 33.44,6.97 v33.07,7.82
D16/CS.OLED  (via drill 0.35)
  Top 0.152: U4.13 16.73,19.25 v16.73,20.86 | v29.69,27.06 U2.30
  Bottom 0.152: v16.73,20.86 22.93,27.06 v29.69,27.06
D27/CHRG.STATUS  (via drill 0.35)  (2 unrouted)
  Bottom 0.152: R5.1 11.07,9.45 v11.07,12.14
D30/LED.CTRL  (via drill 0.35)
  Top 0.152: U2.7 20.99,27.05 v20.73,27.31
  Bottom 0.152: v20.73,27.31 16.84,27.31 16.52,26.99 16.01,26.99 15.66,27.34 15.66,27.42 J1.5
DFU  (via drill 0.35)
  Top 0.152: U2.34 29.99,29.85 v29.98,29.86 | SW1.3 35.36,36.6 v35.32,36.56
  Bottom 0.152: v29.98,29.86 29.98,32.6 31.31,33.92 32.25,33.92 34.8,36.47 35.32,36.47 v35.32,36.56
DTR  (via drill 0.35)
  Top 0.152: C14.1 33.68,11.5 33.68,7.57 31.71,5.6 25.09,5.6 24.8,5.88 24.85,5.93 v24.85,8.3 | U1.1 5.99,12.87 19.62,12.87 v19.68,12.93
  Bottom 0.152: v19.68,12.93 24.31,8.3 v24.85,8.3
GND  (via drill 0.35)  (35 unrouted)
  Top 0.152: U4.1 7.62,19.2 v7.61,19.19 | C19.1 12.79,23.33 v12.75,23.37 13.94,23.37 v13.96,23.35 14,23.3 C20.1 | U4.8 v13.28,17.53 v13.27,17.52 14.69,17.52 v14.71,17.5 | v15.36,24.06 15.39,24.03 R17.1 15.61,23.11 | U4.10 14.71,19.17 v14.71,17.5 | U4.12 16.08,17.54 v16.05,17.51 v16.05,17.5 v14.71,17.5 | U4.29 U4.30 28.72,19.24 29.39,19.24 v29.39,19.27 29.39,19.2 C15.1 R18.2 31.89,17.04 v32.03,16.9 31.99,16.86 C17.1 | C1.1 13.53,6.62 v14.57,6.62 | C2.2 12.69,1.73 v12.56,1.6 | R12.1 2.02,16.79 J2.1 | C9.2 18.66,23.65 C6.1 17.77,24.77 v17.76,24.78 | U2.12 v21.8,22.1 v21.79,22.09 | LED3.C LED4.C v36.28,20.92 v36.29,20.91 35.63,20.26 35.6,20.26 35.47,20.12 35.47,19.23 36.07,18.63 36.07,17.33 | SW2.3 36.07,17.33 | 36.07,17.33 v36.04,17.36 | U2.39 32.77,33.55 | 32.77,33.55 v32.79,33.52 | SW4.B1 35.69,3.07 v35.66,3.1 | C5.1 15.5,30.45 v15.36,30.32 | U1.16 7.5,7.45 v7.35,7.3 | C4.1 4.19,12.73 v4.71,12.73 | SW1.1 36.45,34.21 36.13,33.9 34.04,33.9 33.69,33.55 32.77,33.55
  Top 0.356: U1.6 5.43,6.81 v6.13,7.51
  Top 0.457: C3.2 16.34,27.52 v16.26,27.59
  Bottom 0.152: DEBUG1.9 DEBUG1.7 DEBUG1.5 DEBUG1.3 33.09,31.49 32.98,31.37 32.47,31.37 32.12,31.73 32.12,32.23 32.79,32.9 v32.79,33.52 | USB1.S2 1.93,5.3 1.92,5.31 1.83,5.4 | USB1.S1 2.71,3.44 USB1.S5 | USB1.S3 1.96,7.24 1.64,6.92
  pour Bottom (isolate 0.178): 37.78,34.58 0.15,34.58 0.15,0.17 37.77,0.17
LED1
  Top 0.152: R10.2 33.8,25.99 32.04,27.75 U2.31
LED2
  Top 0.152: R15.2 35.32,25.71 34.42,26.61 33.64,26.61 33.34,26.91 33.34,28.75 32.95,29.14 31.38,29.14 U2.33
MOSI  (via drill 0.35)
  Top 0.152: U4.19 20.98,17.72 v21.19,17.51 | U2.27 v29.75,24.95
  Bottom 0.152: v21.19,17.51 26.45,22.77 27.57,22.77 v29.75,24.95
N$1
  Top 0.152: U4.11 15.39,19.21 R17.2
N$2
  Top 0.152: R18.1 30.85,20.88 26.27,20.88 25.88,20.49 U4.26
N$3
  Top 0.152: C18.2 U4.2
N$4
  Top 0.152: U2.13 23.32,22.05 23.32,21.34 22.85,20.87 21.2,20.87 XTAL1.P$1 | 17.84,21.95 C6.2 17.83,21.95 18.22,21.55 20.52,21.55 XTAL1.P$1 | 20.48,21.27 XTAL1.P$1
N$5
  Top 0.152: C18.1 9.78,21.54 U4.3
N$6
  Top 0.152: 24.02,22.05 U2.14 23.97,23.04 23.61,23.41 21.33,23.41 20.82,22.9 | XTAL1.P$2 20.82,22.9 | C9.1 19.61,22.9 20.82,22.9
N$7
  Top 0.152: C16.2 10.48,20.91 U4.4
N$8
  Top 0.152: C16.1 11.18,21.62 U4.5
N$9
  Top 0.152: R10.1 33.8,22.96 LED3.A
N$10
  Top 0.152: R15.1 35.41,23.39 35.24,23.22 LED4.A
N$11
  Top 0.457: L1.1 18.73,24.95 U2.10
N$12
  Top 0.457: U2.9 19.73,25.65 L1.2 19.25,27.4 C3.1
N$13
  Top 0.152: C15.2 30.44,20.01 29.89,20.57 27.53,20.57 27.28,20.32 U4.28
N$15
  Top 0.152: 26.58,20.23 U4.27 26.58,17.56 27.28,16.86 C17.2
N$17
  Bottom 0.152: R8.2 7.05,12.12 7.59,11.58 7.59,9.22 8.27,8.54 CHRG1.5
N$23
  Top 0.152: U1.12 10.02,4.91 R3.2
N$24
  Top 0.152: U1.11 8.46,3.74 9.19,3.01 R4.2
N$25
  Top 0.152: R6.2 LED1.C
N$26
  Top 0.152: R7.2 | R7.2 LED2.C
RESET  (via drill 0.35)
  Top 0.152: 36.32,15.34 R16.1 | R16.1 36.4,14.97 D3.+ 36.4,12.52 C14.2 | SW2.1 34.86,16.05 35.46,16.05 36.18,15.33 R16.1 | R16.1 36.18,15.54 36.91,16.27 36.91,26.7 DEBUG1.10 | U2.35 32.75,30.55 v32.78,30.58
  Bottom 0.152: v32.78,30.58 32.81,30.55 32.81,29.21 33.35,28.68 33.35,27.05 33.49,26.91 35.36,26.91 35.93,27.47 DEBUG1.10
RXD.FT
  Top 0.152: 17.81,10.66 R14.1 16.55,10.74 16.11,11.19 7.44,11.19 4.33,8.08 U1.4
RXD.NFR  (via drill 0.35)
  Top 0.152: U2.21 28.87,24.25 v28.53,24.59 | v18.68,12.04 18.68,11.41 18.68,9.91 R13.2
  Bottom 0.152: v28.53,24.59 28.3,24.35 27.44,24.35 26.46,23.38 26.19,23.38 21.25,18.44 19.9,18.44 18.68,17.22 v18.68,12.04
RXLED
  Top 0.152: U1.17 R6.1
SCK  (via drill 0.35)
  Top 0.152: U4.18 v20.28,17.53 | v20.28,17.53 | v29.7,24.04 29.91,24.25 U2.26
  Bottom 0.152: v20.28,17.53 20.31,17.53 20.94,16.9 21.44,16.9 21.8,17.26 21.8,17.68 26.57,22.46 27.69,22.46 29.27,24.04 v29.7,24.04
SCL  (via drill 0.35)
  Top 0.152: U2.3 20.84,29.85 v20.82,29.88 | R2.1 4.94,31.85 5.71,31.85 6.27,32.4 J1.2
  Bottom 0.152: J1.2 6.4,33 7.13,33.74 16.97,33.74 v20.82,29.89 v20.82,29.88
SDA  (via drill 0.35)
  Top 0.152: U2.2 21.93,30.78 v20.82,30.78 | R1.1 1.77,33.6 2.52,34.35 3.81,34.35 3.95,34.22 3.95,34.05 J1.1
  Bottom 0.152: J1.1 5.23,33 6.27,34.04 17.21,34.04 20.46,30.78 v20.82,30.78
SWCLK
  Top 0.152: DEBUG1.4 36.87,32.44 36.87,33.19 36.48,33.58 34.16,33.58 33.58,33 33.58,31.47 33.35,31.25 U2.36
SWDIO  (via drill 0.35)
  Top 0.152: U2.37 31.43,32 32.73,32 v32.73,31.98
  Bottom 0.152: v32.73,31.98 32.91,31.98 33.58,32.65 33.58,33.38 33.86,33.67 35.36,33.67 35.93,33.1 DEBUG1.2
SWO  (via drill 0.35)
  Top 0.152: v32.7,28.46 32.68,28.45 U2.32
  Bottom 0.152: v32.7,28.46 32.64,28.41 32.64,27.27 33.38,26.52 35.88,26.52 36.85,27.49 36.85,30 36.63,30.22 DEBUG1.6
TXD.FT
  Top 0.152: R13.1 9.95,8.95 9.13,9.77 8.68,9.77 U1.20
TXD.NFR  (via drill 0.35)
  Top 0.152: U2.19 27.47,23.53 v27.69,23.75 | v19.63,12.02 19.63,10.79 R14.2
  Bottom 0.152: v27.69,23.75 27.01,23.07 26.32,23.07 21.38,18.13 20.03,18.13 19.07,17.18 19.07,12.59 v19.63,12.02
TXLED
  Top 0.152: R7.1 10.03,10.84 7.61,10.84 6.74,9.97 6.74,7.21 6.43,6.9 6.19,6.9 3.57,4.29 3.12,4.29 U1.10
USB+  (via drill 0.35)
  Top 0.152: R4.1 11.81,3.01 | 11.81,3.01 13.04,3.01 C2.1 | v6.9,5.38 6.48,5.38 6.27,5.16 6.27,3.67 8.05,1.89 11.42,1.89 11.81,2.28 11.81,3.01
  Bottom 0.152: USB1.3 6.39,6.54 6.76,6.17 6.76,5.52 v6.9,5.38
USB-  (via drill 0.35)
  Top 0.152: R3.1 13.49,4.89 C1.2 13.49,4.78 14.19,4.08 14.19,2.79 14.06,2.65 12.75,2.65 11.68,1.58 7.91,1.58 5.95,3.54 5.95,5.71 v6.14,5.9
  Bottom 0.152: USB1.2 6.13,5.88 v6.14,5.9
V_USB  (via drill 0.35)
  Top 0.152: v7.34,6.38 7.89,6.93 8.01,6.81 U1.15
  Bottom 0.152: v7.34,6.38 7.34,5.8 7.51,5.63 7.51,5.13 7.15,4.77 6.99,4.77 D2.+
  Bottom 0.406: D2.+ 5.83,5.23 5.81,5.24 USB1.1
VIN
  Bottom 0.152: LDO1.3 12.42,4.38 12.39,4.41 12.27,4.29 12.27,2.49 | CHRG1.4 11.62,7.18 R5.2
  Bottom 0.61: 10.23,2.34 10.16,2.4 C7.2 10.17,5.81 CHRG1.4
  Bottom 0.711: D2.- D1.- 8.5,2.34 10.23,2.34 11.38,2.34 C8.2 12.27,2.49 LDO1.1
VLIPO
  Top 0.152: R11.2 3.68,15.9 J2.2
  Bottom 0.61: J2.2 7.12,14.19 C13.1 10.17,11.14 CHRG1.3 10.17,9.1 9.05,7.98 9.05,5.19 D1.+